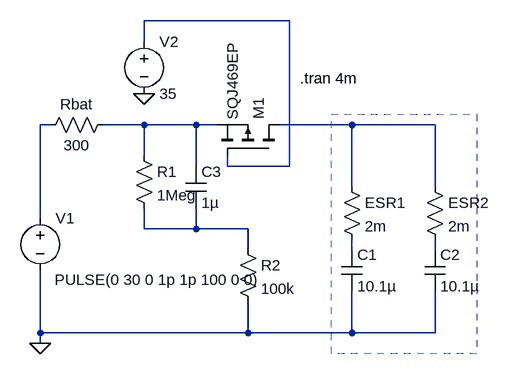
[diagram p0: schematic inrush_current_limiter.asc]
inrush_current_limiter.asc, the LTspice schematic file:
Version 4
SHEET 1 880 680
WIRE 384 -96 160 -96
WIRE 160 -64 160 -96
WIRE 16 64 0 64
WIRE 160 64 96 64
WIRE 240 64 160 64
WIRE 272 64 240 64
WIRE 480 64 368 64
WIRE 608 64 480 64
WIRE 160 112 160 64
WIRE 240 128 240 64
WIRE 288 128 288 112
WIRE 384 128 384 -96
WIRE 384 128 288 128
WIRE 480 160 480 64
WIRE 608 160 608 64
WIRE 0 208 0 64
WIRE 160 224 160 192
WIRE 240 224 240 192
WIRE 240 224 160 224
WIRE 320 224 240 224
WIRE 320 256 320 224
WIRE 480 256 480 240
WIRE 608 256 608 240
WIRE 0 384 0 288
WIRE 320 384 320 336
WIRE 320 384 0 384
WIRE 480 384 480 320
WIRE 480 384 320 384
WIRE 608 384 608 320
WIRE 608 384 480 384
WIRE 0 400 0 384
FLAG 0 400 0
FLAG 160 16 0
SYMBOL voltage 0 192 R0
WINDOW 123 0 0 Left 0
WINDOW 39 0 0 Left 0
WINDOW 3 22 110 Left 2
SYMATTR InstName V1
SYMATTR Value PULSE(0 30 0 1p 1p 100 0 0)
SYMBOL cap 464 256 R0
SYMATTR InstName C1
SYMATTR Value 10.1µ
SYMBOL res 464 144 R0
SYMATTR InstName ESR1
SYMATTR Value 2m
SYMBOL res 0 80 R270
WINDOW 0 32 56 VTop 2
WINDOW 3 0 56 VBottom 2
SYMATTR InstName Rbat
SYMATTR Value 300
SYMBOL res 592 144 R0
SYMATTR InstName ESR2
SYMATTR Value 2m
SYMBOL cap 592 256 R0
SYMATTR InstName C2
SYMATTR Value 10.1µ
SYMBOL cap 224 128 R0
SYMATTR InstName C3
SYMATTR Value 1µ
SYMBOL res 304 240 R0
SYMATTR InstName R2
SYMATTR Value 100k
SYMBOL res 144 96 R0
SYMATTR InstName R1
SYMATTR Value 1Meg
SYMBOL pmos 368 112 M270
SYMATTR InstName M1
SYMATTR Value SQJ469EP
SYMBOL voltage 160 -80 R0
SYMATTR InstName V2
SYMATTR Value 35
TEXT 400 -8 Left 2 !.tran 4m
RECTANGLE Normal 672 416 448 48 2

The netlist it stands for:
* inrush_current_limiter.asc
V1 N002 0 PULSE(0 30 0 1p 1p 100 0 0)
C1 N006 0 10.1µ
R§ESR1 N004 N006 2m
Rbat N002 N003 300
R§ESR2 N004 N007 2m
C2 N007 0 10.1µ
C3 N003 N005 1µ
R2 N005 0 100k
R1 N003 N005 1Meg
M1 N004 N001 N003 N003 SQJ469EP
V2 N001 0 35
.model NMOS NMOS
.model PMOS PMOS
.lib standard.mos
.tran 4m
.backanno
.end